# Altium schematic sheet microbit-motion-tracking.SchDoc: microbit_expansion
size A4; DocumentNumber: 7; SheetNumber: 7; SheetTotal: 7
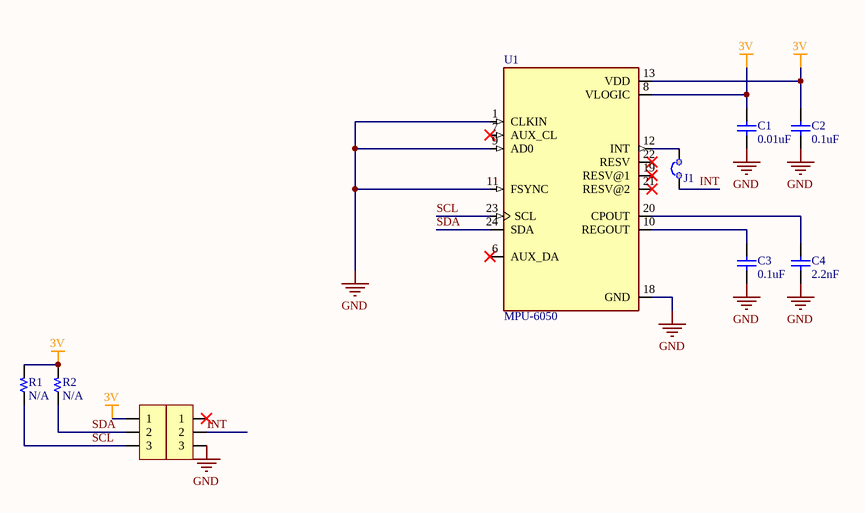
[diagram p0: microbit-motion-tracking.SchDoc]

## Parts
C1  0.01uF  [C 0603]
C2  0.1uF  [C 0603]
C3  0.1uF  [C 0603]
C4  2.2nF  [C 0603]
J1  JUMP 2  [JUMP/2/SMD/D]  (value not drawn)  (no BOM)
P1  Header 3  [HDR/Header/3/c1]  (value not drawn)
P2  Header 3  [HDR/Header/3/c1]  (value not drawn)
R1  N/A  [R 0603]
R2  N/A  [R 0603]
U1  MPU-6050  [QFN 50P 24 400X400X95]

## Nets
3V: C1.1 C2.1 P1.1 R1.2 R2.2 U1.8(VLOGIC) U1.13(VDD)
GND: C1.2 C2.2 C3.2 C4.2 P2.3 U1.1(CLKIN) U1.9(AD0) U1.11(FSYNC) U1.18(GND)
INT: J1.1 P2.2
SCL: P1.3 R1.1 U1.23(SCL)
SDA: P1.2 R2.1 U1.24(SDA)
NetC3_1: C3.1 U1.10(REGOUT)
NetC4_1: C4.1 U1.20(CPOUT)
NetJ1_2: J1.2 U1.12(INT)

Not connected (* = marked no-connect by the designer): P2 1*; U1 6(AUX_DA)* 7(AUX_CL)* 19(RESV@1)* 21(RESV@2)* 22(RESV)*

## Notes on the sheet
- Title
- Size:
- Date:
- A4
- Number:
- Time:
- Revision:
- Sheet
- of
- File:

## Library data of the parts
C1-C4 = Capacitor NP: Capacitor non-pol
P1 P2 = Header 3: Header, 3-Pin
R1 R2 = Resistor
U1 = MPU-6050: Accelerometer, Gyroscope, 6 Axis Sensor IÂ²C Output; MF: TDK InvenSense; Price: None; Package: VFQFN-24 TDK InvenSense; MP: MPU-6050; Value: *; Availability: Unavailable; SnapEDA_Link: https://www.snapeda.com/parts/MPU-6050/TDK%20InvenSense/view-part/4503180/?ref=snap